# Altium schematic sheet Main.SchDoc
size A4; SheetNumber: 1; SheetTotal: 5
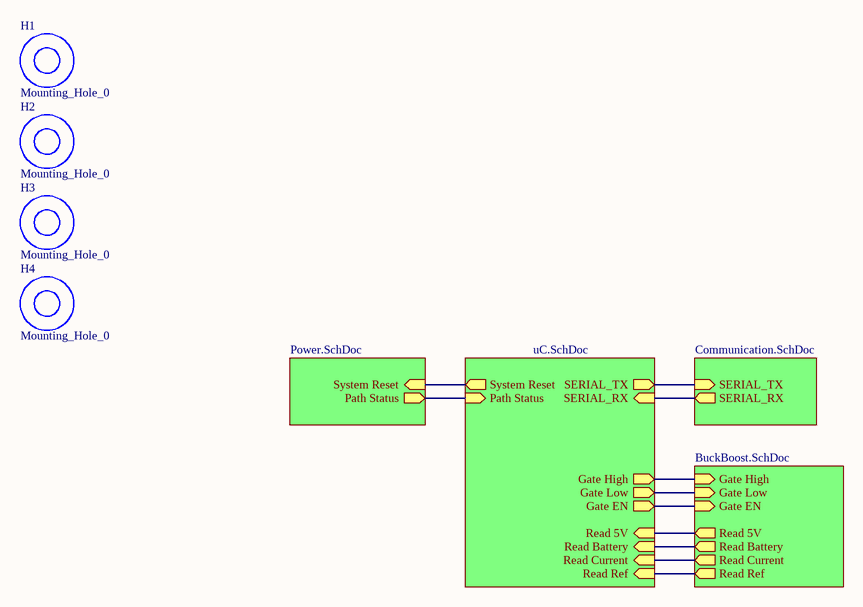
[diagram p0: Main.SchDoc]

## Parts
H1  Mounting_Hole_0  [MOUNTING_HOLE_M3]
H2  Mounting_Hole_0  [MOUNTING_HOLE_M3]
H3  Mounting_Hole_0  [MOUNTING_HOLE_M3]
H4  Mounting_Hole_0  [MOUNTING_HOLE_M3]

## Sub-sheets
Designator = uC.SchDoc: SERIAL_TX (out), SERIAL_RX (in), System Reset (out), Gate Low (out), Gate EN (out), Read 5V (in), Read Battery (in), Read Current (in), Read Ref (in), Gate High (out), Path Status (in)
Designator = Communication.SchDoc: SERIAL_TX (in), SERIAL_RX (out)
Designator = Power.SchDoc: System Reset (in), Path Status (out)
Designator = BuckBoost.SchDoc: Gate Low (in), Gate EN (in), Read 5V (out), Read Battery (out), Read Current (out), Read Ref (out), Gate High (in)

## Nets
(unnamed): sheet Designator/SERIAL_TX, sheet Designator/SERIAL_TX
(unnamed): sheet Designator/SERIAL_RX, sheet Designator/SERIAL_RX
(unnamed): sheet Designator/System Reset, sheet Designator/System Reset
(unnamed): sheet Designator/Gate Low, sheet Designator/Gate Low
(unnamed): sheet Designator/Gate EN, sheet Designator/Gate EN
(unnamed): sheet Designator/Read 5V, sheet Designator/Read 5V
(unnamed): sheet Designator/Read Battery, sheet Designator/Read Battery
(unnamed): sheet Designator/Read Current, sheet Designator/Read Current
(unnamed): sheet Designator/Read Ref, sheet Designator/Read Ref
(unnamed): sheet Designator/Gate High, sheet Designator/Gate High
(unnamed): sheet Designator/Path Status, sheet Designator/Path Status

## Library data of the parts
H1-H4 = Mounting_Hole_0: Mounting hole with no connectivity.